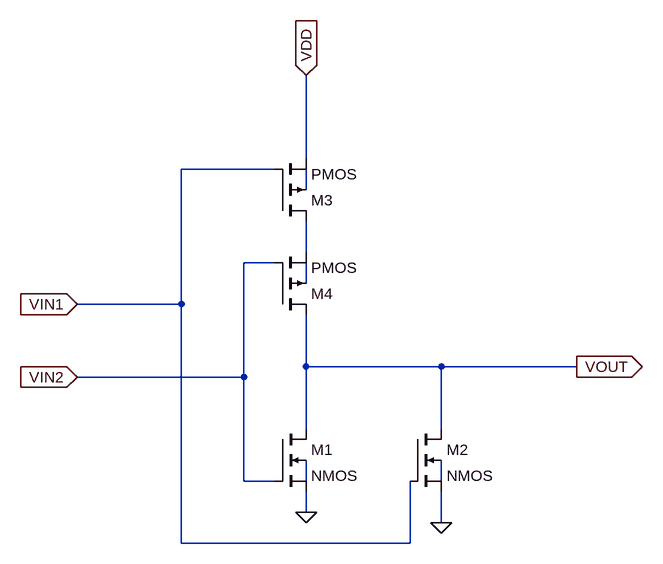
[diagram p0: schematic NOR.asc]
NOR.asc, the LTspice schematic file:
Version 4
SHEET 1 992 680
WIRE 352 -64 352 -192
WIRE 304 -48 160 -48
WIRE 352 -16 352 -48
WIRE 352 80 352 32
WIRE 304 96 256 96
WIRE 352 128 352 96
WIRE 160 160 160 -48
WIRE 160 160 0 160
WIRE 352 256 352 176
WIRE 560 256 352 256
WIRE 768 256 560 256
WIRE 256 272 256 96
WIRE 256 272 0 272
WIRE 352 352 352 256
WIRE 560 352 560 256
WIRE 256 432 256 272
WIRE 304 432 256 432
WIRE 352 432 352 400
WIRE 560 432 560 400
WIRE 352 480 352 448
WIRE 560 496 560 448
WIRE 160 528 160 160
WIRE 512 528 512 432
WIRE 512 528 160 528
FLAG 352 480 0
FLAG 560 496 0
FLAG 0 160 VIN1
IOPIN 0 160 In
FLAG 0 272 VIN2
IOPIN 0 272 In
FLAG 352 -192 VDD
IOPIN 352 -192 In
FLAG 768 256 VOUT
IOPIN 768 256 Out
SYMBOL nmos4 304 352 R0
SYMATTR InstName M1
SYMATTR Value2 l=90n w=200n
SYMBOL nmos4 512 352 R0
SYMATTR InstName M2
SYMATTR Value2 l=90n w=200n
SYMBOL pmos4 304 32 M180
SYMATTR InstName M3
SYMATTR Value2 l=90n w=400n
SYMBOL pmos4 304 176 M180
SYMATTR InstName M4
SYMATTR Value2 l=90n w=400n

The netlist it stands for:
* NOR.asc
M1 VOUT VIN2 0 N004 NMOS l=90n w=200n
M2 VOUT VIN1 0 N005 NMOS l=90n w=200n
M3 N002 VIN1 VDD N001 PMOS l=90n w=400n
M4 VOUT VIN2 N002 N003 PMOS l=90n w=400n
.model NMOS NMOS
.model PMOS PMOS
.lib standard.mos
.backanno
.end